# Altium schematic sheet PAGE09 Connectors.SchDoc
size 297 x 209 mm
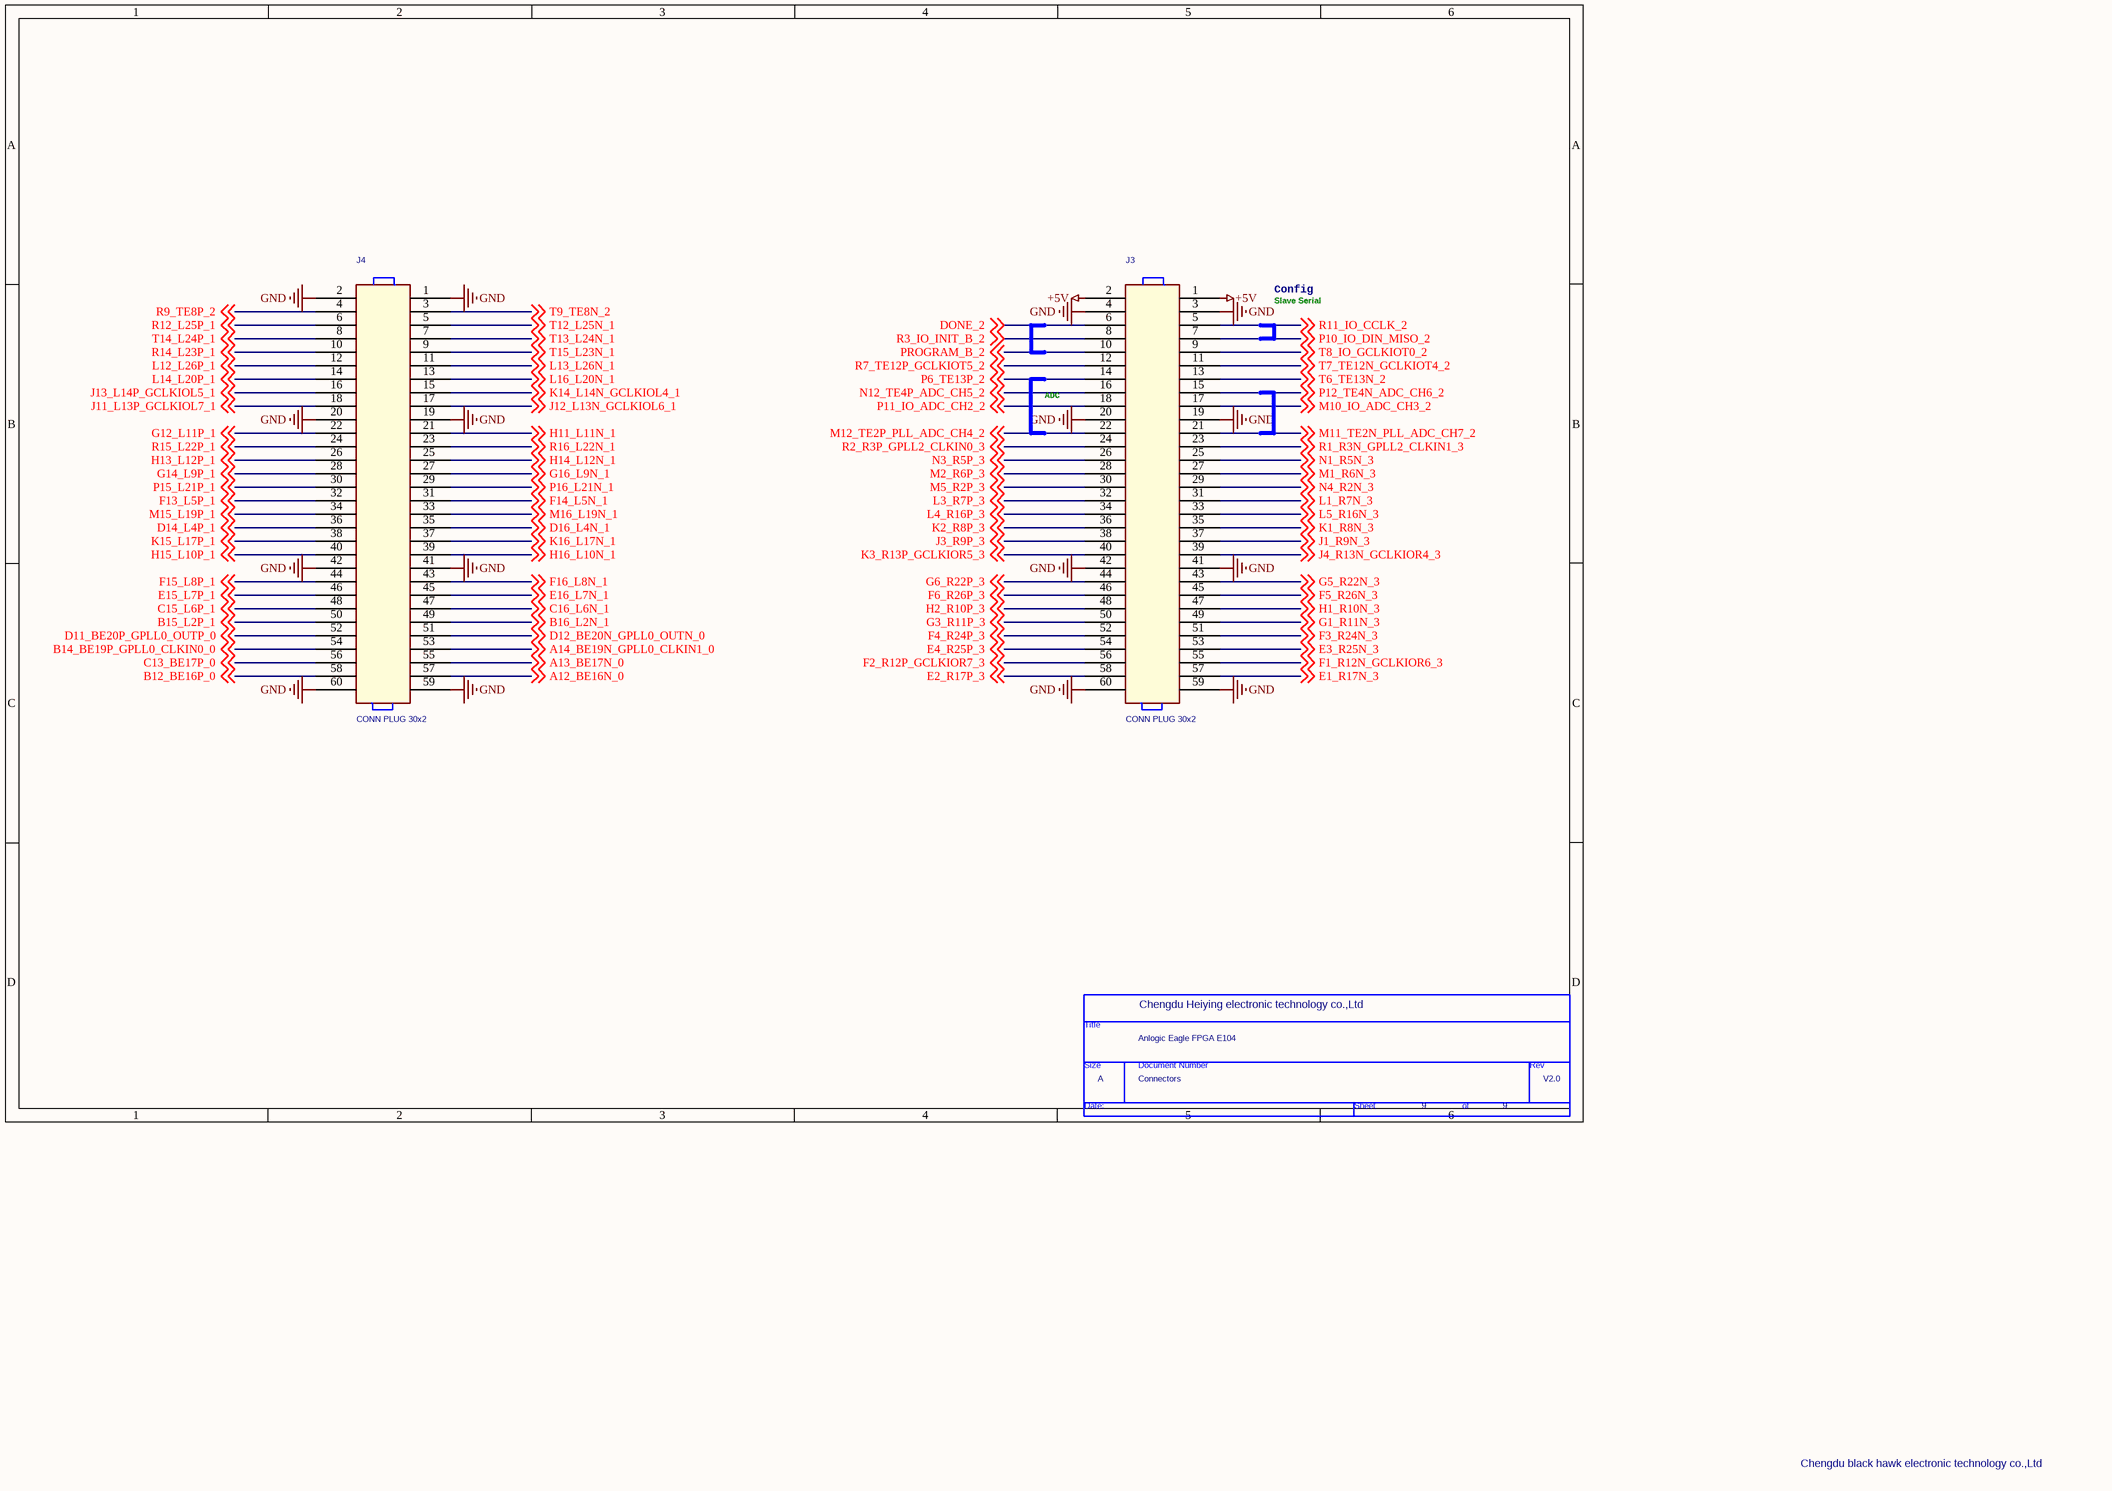
[diagram p0: PAGE09 Connectors.SchDoc]

## Parts
*  Page Count: 9  Page Size: A  Title: Anlogic Eagle FPGA E104  RevCode: V2.0  Doc: Connectors  (hidden comment: TitleBlock0)  (graphical)
J3  CONN PLUG 30x2  [DIP2X30_2P54]
J4  CONN PLUG 30x2  [DIP2X30_2P54]

## Nets
+5V: J3.1 J3.2
GND: J3.3 J3.4 J3.19 J3.20 J3.41 J3.42 J3.59 J3.60 J4.1 J4.2 J4.19 J4.20 J4.41 J4.42 J4.59 J4.60
A12_BE16N_0: J4.57 ; off-sheet A12_BE16N_0
A13_BE17N_0: J4.55 ; off-sheet A13_BE17N_0
A14_BE19N_GPLL0_CLKIN1_0: J4.53 ; off-sheet A14_BE19N_GPLL0_CLKIN1_0
B12_BE16P_0: J4.58 ; off-sheet B12_BE16P_0
B14_BE19P_GPLL0_CLKIN0_0: J4.54 ; off-sheet B14_BE19P_GPLL0_CLKIN0_0
B15_L2P_1: J4.50 ; off-sheet B15_L2P_1
B16_L2N_1: J4.49 ; off-sheet B16_L2N_1
C13_BE17P_0: J4.56 ; off-sheet C13_BE17P_0
C15_L6P_1: J4.48 ; off-sheet C15_L6P_1
C16_L6N_1: J4.47 ; off-sheet C16_L6N_1
D11_BE20P_GPLL0_OUTP_0: J4.52 ; off-sheet D11_BE20P_GPLL0_OUTP_0
D12_BE20N_GPLL0_OUTN_0: J4.51 ; off-sheet D12_BE20N_GPLL0_OUTN_0
D14_L4P_1: J4.36 ; off-sheet D14_L4P_1
D16_L4N_1: J4.35 ; off-sheet D16_L4N_1
DONE_2: J3.6 ; off-sheet DONE_2
E1_R17N_3: J3.57 ; off-sheet E1_R17N_3
E2_R17P_3: J3.58 ; off-sheet E2_R17P_3
E3_R25N_3: J3.53 ; off-sheet E3_R25N_3
E4_R25P_3: J3.54 ; off-sheet E4_R25P_3
E15_L7P_1: J4.46 ; off-sheet E15_L7P_1
E16_L7N_1: J4.45 ; off-sheet E16_L7N_1
F1_R12N_GCLKIOR6_3: J3.55 ; off-sheet F1_R12N_GCLKIOR6_3
F2_R12P_GCLKIOR7_3: J3.56 ; off-sheet F2_R12P_GCLKIOR7_3
F3_R24N_3: J3.51 ; off-sheet F3_R24N_3
F4_R24P_3: J3.52 ; off-sheet F4_R24P_3
F5_R26N_3: J3.45 ; off-sheet F5_R26N_3
F6_R26P_3: J3.46 ; off-sheet F6_R26P_3
F13_L5P_1: J4.32 ; off-sheet F13_L5P_1
F14_L5N_1: J4.31 ; off-sheet F14_L5N_1
F15_L8P_1: J4.44 ; off-sheet F15_L8P_1
F16_L8N_1: J4.43 ; off-sheet F16_L8N_1
G1_R11N_3: J3.49 ; off-sheet G1_R11N_3
G3_R11P_3: J3.50 ; off-sheet G3_R11P_3
G5_R22N_3: J3.43 ; off-sheet G5_R22N_3
G6_R22P_3: J3.44 ; off-sheet G6_R22P_3
G12_L11P_1: J4.22 ; off-sheet G12_L11P_1
G14_L9P_1: J4.28 ; off-sheet G14_L9P_1
G16_L9N_1: J4.27 ; off-sheet G16_L9N_1
H1_R10N_3: J3.47 ; off-sheet H1_R10N_3
H2_R10P_3: J3.48 ; off-sheet H2_R10P_3
H11_L11N_1: J4.21 ; off-sheet H11_L11N_1
H13_L12P_1: J4.26 ; off-sheet H13_L12P_1
H14_L12N_1: J4.25 ; off-sheet H14_L12N_1
H15_L10P_1: J4.40 ; off-sheet H15_L10P_1
H16_L10N_1: J4.39 ; off-sheet H16_L10N_1
J1_R9N_3: J3.37 ; off-sheet J1_R9N_3
J3_R9P_3: J3.38 ; off-sheet J3_R9P_3
J4_R13N_GCLKIOR4_3: J3.39 ; off-sheet J4_R13N_GCLKIOR4_3
J11_L13P_GCLKIOL7_1: J4.18 ; off-sheet J11_L13P_GCLKIOL7_1
J12_L13N_GCLKIOL6_1: J4.17 ; off-sheet J12_L13N_GCLKIOL6_1
J13_L14P_GCLKIOL5_1: J4.16 ; off-sheet J13_L14P_GCLKIOL5_1
K1_R8N_3: J3.35 ; off-sheet K1_R8N_3
K2_R8P_3: J3.36 ; off-sheet K2_R8P_3
K3_R13P_GCLKIOR5_3: J3.40 ; off-sheet K3_R13P_GCLKIOR5_3
K14_L14N_GCLKIOL4_1: J4.15 ; off-sheet K14_L14N_GCLKIOL4_1
K15_L17P_1: J4.38 ; off-sheet K15_L17P_1
K16_L17N_1: J4.37 ; off-sheet K16_L17N_1
L1_R7N_3: J3.31 ; off-sheet L1_R7N_3
L3_R7P_3: J3.32 ; off-sheet L3_R7P_3
L4_R16P_3: J3.34 ; off-sheet L4_R16P_3
L5_R16N_3: J3.33 ; off-sheet L5_R16N_3
L12_L26P_1: J4.12 ; off-sheet L12_L26P_1
L13_L26N_1: J4.11 ; off-sheet L13_L26N_1
L14_L20P_1: J4.14 ; off-sheet L14_L20P_1
L16_L20N_1: J4.13 ; off-sheet L16_L20N_1
M1_R6N_3: J3.27 ; off-sheet M1_R6N_3
M2_R6P_3: J3.28 ; off-sheet M2_R6P_3
M5_R2P_3: J3.30 ; off-sheet M5_R2P_3
M10_IO_ADC_CH3_2: J3.17 ; off-sheet M10_IO_ADC_CH3_2
M11_TE2N_PLL_ADC_CH7_2: J3.21 ; off-sheet M11_TE2N_PLL_ADC_CH7_2
M12_TE2P_PLL_ADC_CH4_2: J3.22 ; off-sheet M12_TE2P_PLL_ADC_CH4_2
M15_L19P_1: J4.34 ; off-sheet M15_L19P_1
M16_L19N_1: J4.33 ; off-sheet M16_L19N_1
N1_R5N_3: J3.25 ; off-sheet N1_R5N_3
N3_R5P_3: J3.26 ; off-sheet N3_R5P_3
N4_R2N_3: J3.29 ; off-sheet N4_R2N_3
N12_TE4P_ADC_CH5_2: J3.16 ; off-sheet N12_TE4P_ADC_CH5_2
P6_TE13P_2: J3.14 ; off-sheet P6_TE13P_2
P10_IO_DIN_MISO_2: J3.7 ; off-sheet P10_IO_DIN_MISO_2
P11_IO_ADC_CH2_2: J3.18 ; off-sheet P11_IO_ADC_CH2_2
P12_TE4N_ADC_CH6_2: J3.15 ; off-sheet P12_TE4N_ADC_CH6_2
P15_L21P_1: J4.30 ; off-sheet P15_L21P_1
P16_L21N_1: J4.29 ; off-sheet P16_L21N_1
PROGRAM_B_2: J3.10 ; off-sheet PROGRAM_B_2
R1_R3N_GPLL2_CLKIN1_3: J3.23 ; off-sheet R1_R3N_GPLL2_CLKIN1_3
R2_R3P_GPLL2_CLKIN0_3: J3.24 ; off-sheet R2_R3P_GPLL2_CLKIN0_3
R3_IO_INIT_B_2: J3.8 ; off-sheet R3_IO_INIT_B_2
R7_TE12P_GCLKIOT5_2: J3.12 ; off-sheet R7_TE12P_GCLKIOT5_2
R9_TE8P_2: J4.4 ; off-sheet R9_TE8P_2
R11_IO_CCLK_2: J3.5 ; off-sheet R11_IO_CCLK_2
R12_L25P_1: J4.6 ; off-sheet R12_L25P_1
R14_L23P_1: J4.10 ; off-sheet R14_L23P_1
R15_L22P_1: J4.24 ; off-sheet R15_L22P_1
R16_L22N_1: J4.23 ; off-sheet R16_L22N_1
T6_TE13N_2: J3.13 ; off-sheet T6_TE13N_2
T7_TE12N_GCLKIOT4_2: J3.11 ; off-sheet T7_TE12N_GCLKIOT4_2
T8_IO_GCLKIOT0_2: J3.9 ; off-sheet T8_IO_GCLKIOT0_2
T9_TE8N_2: J4.3 ; off-sheet T9_TE8N_2
T12_L25N_1: J4.5 ; off-sheet T12_L25N_1
T13_L24N_1: J4.7 ; off-sheet T13_L24N_1
T14_L24P_1: J4.8 ; off-sheet T14_L24P_1
T15_L23N_1: J4.9 ; off-sheet T15_L23N_1

## Notes on the sheet
- Config
- Slave Serial
- ADC
- Chengdu Heiying electronic technology co.,Ltd
- Chengdu black hawk electronic technology co.,Ltd
- (in symbol TitleBlock0) Title; Size; Document Number; Rev; Date:; Sheet; of

## Library data of the parts
* = TitleBlock0: Page Number: 9; Page Create Date: March  8, 1995